# Altium project 3D_Scanner_Gesamt.PrjPcb
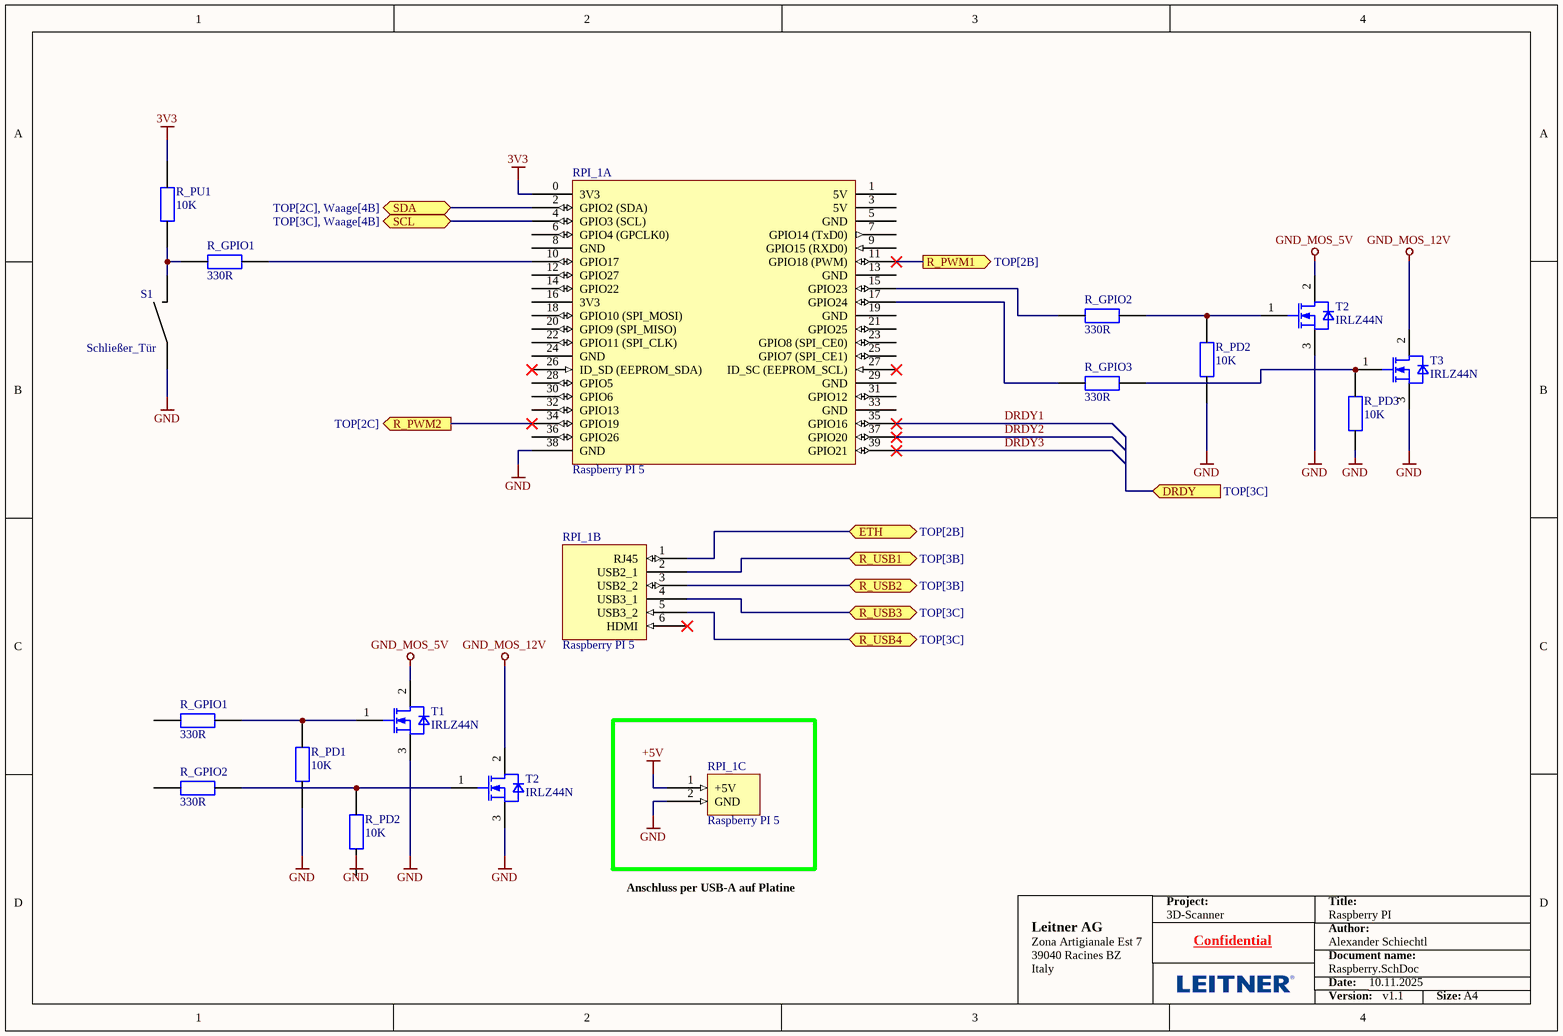
[diagram p0: Raspberry.SchDoc]
1 sheet, 17 parts. Net scope: flat (ports and power ports of the same name join across sheets).

## Sheet Raspberry.SchDoc: Raspberry PI
size A4; Date: 10.11.2025; Author: Alexander Schiechtl; Revision: v1.1; SheetNumber: 3; SheetTotal: 6; Project: 3D-Scanner; SPICEModelCacheFICJDGAN: <root> / <DocumentId>FICJDGAN</DocumentId> / <CacheFrame Number="0"> / <Model Name="irlz44n" Kind="CKT"> / <Text>.SUBCKT irlz44n 1 2 3 / ************************************** / *      Model Generated by MODPEX     * / *Copyright(c) Symmetry Design Systems* / *         All Rights Reserved        * / *    UNPUBLISHED LICENSED SOFTWARE   * / *   Contains Proprietary Information * / *      Which is The Property of      * / *     SYMMETRY OR ITS LICENSORS      * / *Commercial Use or Resale Restricted * / *   by Symmetry License Agreement    * / ************************************** / * Model generated on Apr 24, 96 / * Model format: SPICE3 / * Symmetry POWER MOS Model (Version 1.0) / * External Node Designations / * Node 1 -&gt; Drain / * Node 2 -&gt; Gate / * Node 3 -&gt; Source / M1 9 7 8 8 MM L=100u W=100u / * Default values used in MM: / * The voltage-dependent capacitances are / * not included. Other default values are: / *   RS=0 RD=0 LD=0 CBD=0 CBS=0 CGBO=0 / .MODEL MM NMOS LEVEL=1 IS=1e-32 / +VTO=2.08819 LAMBDA=0.0038193 KP=67.9211 / +CGSO=1.59143e-05 CGDO=3.04562e-08 / RS 8 3 0.014066 / D1 3 1 MD / .MODEL MD D IS=4.4574e-09 RS=0.007275 N=1.40246 BV=55 / +IBV=0.00025 EG=1.14011 XTI=3.00078 TT=0 / +CJO=8.92434e-10 VJ=4.94724 M=0.75496 FC=0.5 / RDS 3 1 2.2e+06 / RD 9 1 0.00179971 / RG 2 7 2.4114 / D2 4 5 MD1 / * Default values used in MD1: / *   RS=0 EG=1.11 XTI=3.0 TT=0 / *   BV=infinite IBV=1mA / .MODEL MD1 D IS=1e-32 N=50 / +CJO=1.15401e-09 VJ=0.859156 M=0.642548 FC=1e-08 / D3 0 5 MD2 / * Default values used in MD2: / *   EG=1.11 XTI=3.0 TT=0 CJO=0 / *   BV=infinite IBV=1mA / .MODEL MD2 D IS=1e-10 N=0.4 RS=3e-06 / RL 5 10 1 / FI2 7 9 VFI2 -1 / VFI2 4 0 0 / EV16 10 0 9 7 1 / CAP 11 10 3.64838e-09 / FI1 7 9 VFI1 -1 / VFI1 11 6 0 / RCAP 6 10 1 / D4 0 6 MD3 / * Default values used in MD3: / *   EG=1.11 XTI=3.0 TT=0 CJO=0 / *   RS=0 BV=infinite IBV=1mA / .MODEL MD3 D IS=1e-10 N=0.4 / .ENDS</Text> / </Model> / </CacheFrame> / </root>

### Parts
(Parts that share a designator on the sheet are numbered #1, #2 ... from top to bottom, then left to right.)
R_GPIO1#1  330R
R_GPIO1#2  330R
R_GPIO2#1  330R
R_GPIO2#2  330R
R_GPIO3  330R
R_PD1  10K
R_PD2#1  10K
R_PD2#2  10K
R_PD3  10K
R_PU1  10K
RPI_1#1  Raspberry PI 5  (parts A,B of 2)
RPI_1#2  Raspberry PI 5  (part C of 3)
S1  Schließer_Tür
T1  IRLZ44N
T2#1  IRLZ44N
T2#2  IRLZ44N
T3  IRLZ44N

### Ports
DRDY (in, see TOP[3C]), ETH (bidir, see TOP[2B]), R_PWM1 (out, see TOP[2B]), R_PWM2 (out, see TOP[2C]), R_USB1 (bidir, see TOP[3B]), R_USB2 (bidir, see TOP[3B]), R_USB3 (bidir, see TOP[3C]), R_USB4 (bidir, see TOP[3C]), SCL (bidir, see TOP[3C], Waage[4B]), SDA (bidir, see TOP[2C], Waage[4B])

### Nets
3V3: R_PU1.1 RPI_1#1.0(3V3)
+5V: RPI_1#2.1(+5V)
GND: R_PD1.0 R_PD2#1.0 R_PD3.0 RPI_1#1.38(GND) RPI_1#2.2(GND) T1.3(SOURCE) T2#1.3(SOURCE) T2#2.3(SOURCE) T3.3(SOURCE)
GND_MOS_5V: T1.2(DRAIN) T2#1.2(DRAIN)
GND_MOS_12V: T2#2.2(DRAIN) T3.2(DRAIN)
DRDY1: RPI_1#1.35(GPIO16)
DRDY2: RPI_1#1.37(GPIO20)
DRDY3: RPI_1#1.39(GPIO21)
NetR_GPIO1#1_0: R_GPIO1#1.0 R_PU1.0
NetR_GPIO1#1_1: R_GPIO1#1.1 RPI_1#1.10(GPIO17)
NetR_GPIO1#2_1: R_GPIO1#2.1 R_PD1.1 T1.1(GATE)
NetR_GPIO2#1_0: R_GPIO2#1.0 RPI_1#1.15(GPIO23)
NetR_GPIO2#1_1: R_GPIO2#1.1 R_PD2#1.1 T2#1.1(GATE)
NetR_GPIO2#2_1: R_GPIO2#2.1 R_PD2#2.1 T2#2.1(GATE)
NetR_GPIO3_0: R_GPIO3.0 RPI_1#1.17(GPIO24)
NetR_GPIO3_1: R_GPIO3.1 R_PD3.1 T3.1(GATE)
NetRPI_1#1_1: RPI_1#1.1(5V) ; port ETH
NetRPI_1#1_2: RPI_1#1.2(GPIO2_(SDA)) ; port SDA
NetRPI_1#1_2: RPI_1#1.2(USB2_1) ; port R_USB1  [a separate net that carries the same name]
NetRPI_1#1_3: RPI_1#1.3(5V) ; port R_USB2
NetRPI_1#1_4: RPI_1#1.4(GPIO3_(SCL)) ; port SCL
NetRPI_1#1_4: RPI_1#1.4(USB3_1) ; port R_USB3  [a separate net that carries the same name]
NetRPI_1#1_5: RPI_1#1.5(GND) ; port R_USB4
NetRPI_1#1_11: RPI_1#1.11(GPIO18_(PWM)) ; port R_PWM1
NetRPI_1#1_34: RPI_1#1.34(GPIO19) ; port R_PWM2

Not connected (* = marked no-connect by the designer): R_GPIO1#2 0; R_GPIO2#2 0; R_PD2#2 0; RPI_1#1 6(GPIO4_(GPCLK0)) 7(GPIO14_(TxD0)) 8(GND) 9(GPIO15_(RXD0)) 12(GPIO27) 13(GND) 14(GPIO22) 16(3V3) 18(GPIO10_(SPI_MOSI)) 19(GND) 20(GPIO9_(SPI_MISO)) 21(GPIO25) 22(GPIO11_(SPI_CLK)) 23(GPIO8_(SPI_CE0)) 24(GND) 25(GPIO7_(SPI_CE1)) 26(ID_SD_(EEPROM_SDA))* 27(ID_SC_(EEPROM_SCL))* 28(GPIO5) 29(GND) 30(GPIO6) 31(GPIO12) 32(GPIO13) 33(GND) 36(GPIO26)

### Notes on the sheet
- Anschluss per USB-A auf Platine
- Labels drawn without touching a wire or pin: GND
- Project:
- Title:
- Leitner AG
- Zona Artigianale Est 7
- 39040 Racines BZ
- Italy
- Confidential
- Author:
- Document name:
- Date:
- Version:
- Size:
- A4

### Library data of the parts
R_GPIO1#1 R_GPIO1#2 R_GPIO2#1 R_GPIO2#2 R_GPIO3 = R 330: Widerstand: 330R
R_PD1 R_PD2#1 R_PD2#2 R_PD3 R_PU1 = R 10K: Widerstand: 10K
RPI_1#1 = Raspberry PI
RPI_1#2 = Raspberry PI: Versorgung, USB-C
S1 = S_Schließer
T1 T2#1 T2#2 T3 = IRLZ44N: OptiMOS 3 Power-Transistor, VDS 100V; Manufacturer: Infineon Technologies; Manufacturer Order Number: IRLZ44N; PackageReference: PG-TO220-3-904